# Altium schematic sheet 07_CONFIG.SchDoc
size OrCAD B
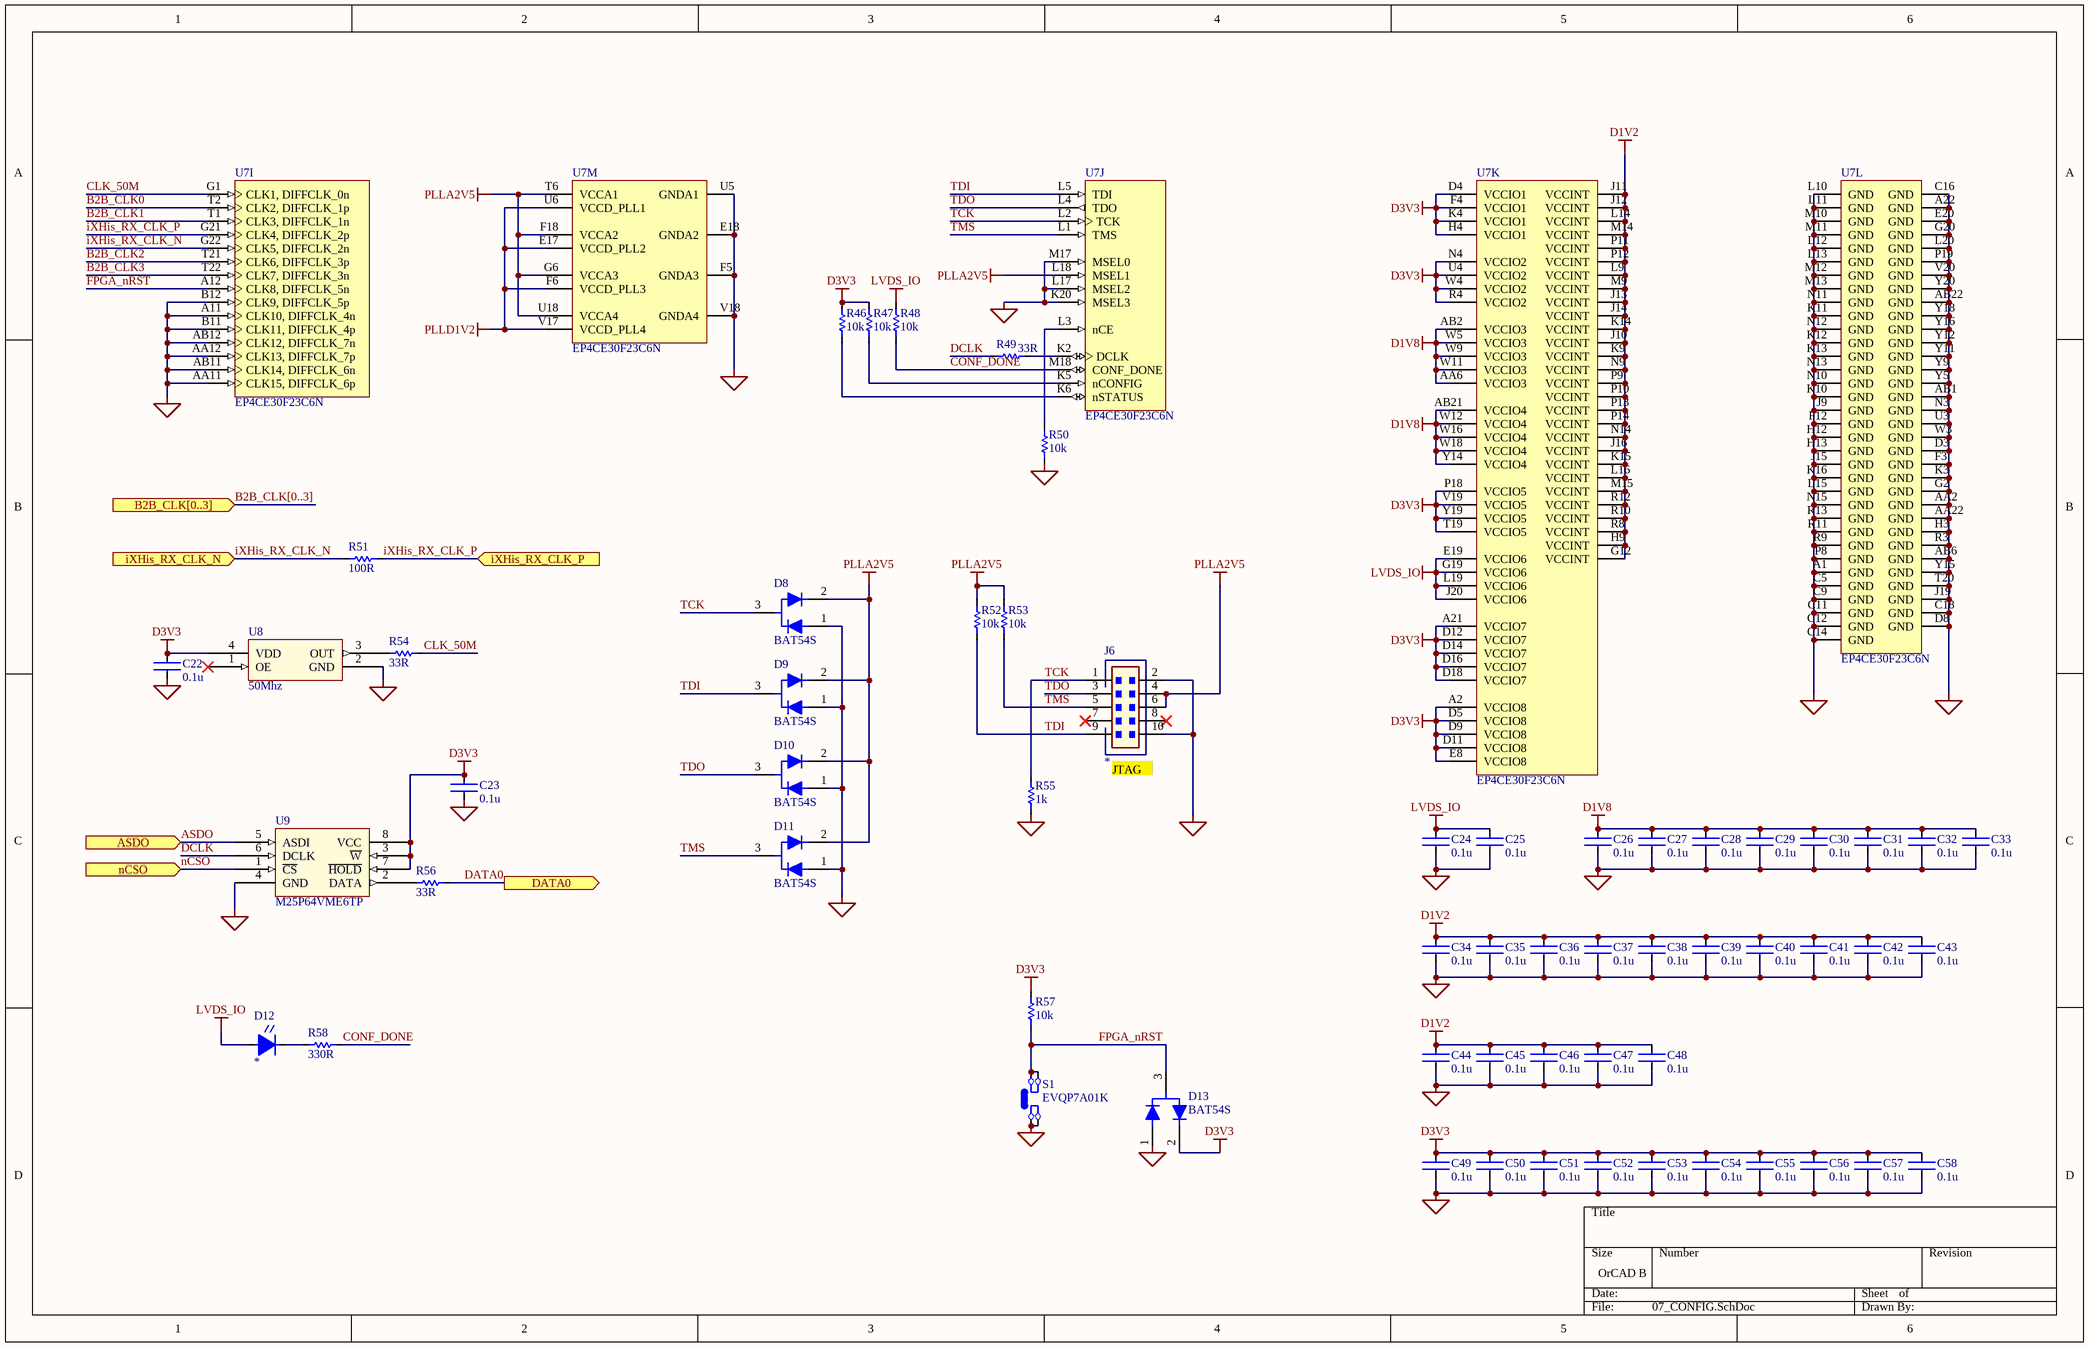
[diagram p0: 07_CONFIG.SchDoc]

## Parts
C22  0.1u  [C0402]
C23  0.1u  [C0402]
C24  0.1u  [C0402]
C25  0.1u  [C0402]
C26  0.1u  [C0402]
C27  0.1u  [C0402]
C28  0.1u  [C0402]
C29  0.1u  [C0402]
C30  0.1u  [C0402]
C31  0.1u  [C0402]
C32  0.1u  [C0402]
C33  0.1u  [C0402]
C34  0.1u  [C0402]
C35  0.1u  [C0402]
C36  0.1u  [C0402]
C37  0.1u  [C0402]
C38  0.1u  [C0402]
C39  0.1u  [C0402]
C40  0.1u  [C0402]
C41  0.1u  [C0402]
C42  0.1u  [C0402]
C43  0.1u  [C0402]
C44  0.1u  [C0402]
C45  0.1u  [C0402]
C46  0.1u  [C0402]
C47  0.1u  [C0402]
C48  0.1u  [C0402]
C49  0.1u  [C0402]
C50  0.1u  [C0402]
C51  0.1u  [C0402]
C52  0.1u  [C0402]
C53  0.1u  [C0402]
C54  0.1u  [C0402]
C55  0.1u  [C0402]
C56  0.1u  [C0402]
C57  0.1u  [C0402]
C58  0.1u  [C0402]
D8  BAT54S  [SOT95P230X110-3N_SOT23_BAT54]
D9  BAT54S  [SOT95P230X110-3N_SOT23_BAT54]
D10  BAT54S  [SOT95P230X110-3N_SOT23_BAT54]
D11  BAT54S  [SOT95P230X110-3N_SOT23_BAT54]
D12  *  [LED0603]
D13  BAT54S  [SOT95P230X110-3N_SOT23_BAT54]
J6  JTAG  [3011001XXX00]  (value not drawn)
R46  10k  [R0402]
R47  10k  [R0402]
R48  10k  [R0402]
R49  33R  [R0402]
R50  10k  [R0402]
R51  100R  [R0402]
R52  10k  [R0402]
R53  10k  [R0402]
R54  33R  [R0402]
R55  1k  [R0402]
R56  33R  [R0402]
R57  10k  [R0402]
R58  330R  [R0402]
S1  EVQP7A01K  [EVQP7A01K]
U7  EP4CE30F23C6N  [FBGA484_EP4CE30F23C6N]  (parts I,J,K,L,M of 13)
U8  50Mhz  [3225_DSO321SR]
U9  M25P64VME6TP  [VDFPN8_M25P64]

## Ports
ASDO (in), B2B_CLK[0..3] (in), DATA0 (out), iXHis_RX_CLK_N (in), iXHis_RX_CLK_P (in), nCSO (in)

## Nets
D1V2: C34.1 C35.1 C36.1 C37.1 C38.1 C39.1 C40.1 C41.1 C42.1 C43.1 C44.1 C45.1 C46.1 C47.1 C48.1 U7.G12(VCCINT) U7.H9(VCCINT) U7.J10(VCCINT) U7.J11(VCCINT) U7.J12(VCCINT) U7.J13(VCCINT) U7.J14(VCCINT) U7.J16(VCCINT) U7.K9(VCCINT) U7.K14(VCCINT) U7.K15(VCCINT) U7.L9(VCCINT) U7.L14(VCCINT) U7.L16(VCCINT) U7.M9(VCCINT) U7.M14(VCCINT) U7.M15(VCCINT) U7.N9(VCCINT) U7.N14(VCCINT) U7.P9(VCCINT) U7.P10(VCCINT) U7.P11(VCCINT) U7.P12(VCCINT) U7.P13(VCCINT) U7.P14(VCCINT) U7.R8(VCCINT) U7.R10(VCCINT) U7.R12(VCCINT)
D1V8: C26.1 C27.1 C28.1 C29.1 C30.1 C31.1 C32.1 C33.1 U7.AA6(VCCIO3) U7.AB2(VCCIO3) U7.AB21(VCCIO4) U7.W5(VCCIO3) U7.W9(VCCIO3) U7.W11(VCCIO3) U7.W12(VCCIO4) U7.W16(VCCIO4) U7.W18(VCCIO4) U7.Y14(VCCIO4)
D3V3: C22.1 C23.1 C49.1 C50.1 C51.1 C52.1 C53.1 C54.1 C55.1 C56.1 C57.1 C58.1 D13.2 R46.2 R47.2 R57.2 U7.A2(VCCIO8) U7.A21(VCCIO7) U7.D4(VCCIO1) U7.D5(VCCIO8) U7.D9(VCCIO8) U7.D11(VCCIO8) U7.D12(VCCIO7) U7.D14(VCCIO7) U7.D16(VCCIO7) U7.D18(VCCIO7) U7.E8(VCCIO8) U7.F4(VCCIO1) U7.H4(VCCIO1) U7.K4(VCCIO1) U7.N4(VCCIO2) U7.P18(VCCIO5) U7.R4(VCCIO2) U7.T19(VCCIO5) U7.U4(VCCIO2) U7.V19(VCCIO5) U7.W4(VCCIO2) U7.Y19(VCCIO5) U8.4(VDD) U9.3(~{W}) U9.7(~{HOLD}) U9.8(VCC)
GND: C22.2 C23.2 C24.2 C25.2 C26.2 C27.2 C28.2 C29.2 C30.2 C31.2 C32.2 C33.2 C34.2 C35.2 C36.2 C37.2 C38.2 C39.2 C40.2 C41.2 C42.2 C43.2 C44.2 C45.2 C46.2 C47.2 C48.2 C49.2 C50.2 C51.2 C52.2 C53.2 C54.2 C55.2 C56.2 C57.2 C58.2 D8.1 D9.1 D10.1 D11.1 D13.1 J6.2 J6.10 R50.1 R55.1 S1.1(CVdd) U7.A1(GND) U7.A11(CLK10,_DIFFCLK_4n) U7.A22(GND) U7.AA2(GND) U7.AA11(CLK15,_DIFFCLK_6p) U7.AA12(CLK13,_DIFFCLK_7p) U7.AA22(GND) U7.AB1(GND) U7.AB6(GND) U7.AB11(CLK14,_DIFFCLK_6n) U7.AB12(CLK12,_DIFFCLK_7n) U7.AB22(GND) U7.B11(CLK11,_DIFFCLK_4p) U7.B12(CLK9,_DIFFCLK_5p) U7.C5(GND) U7.C9(GND) U7.C11(GND) U7.C12(GND) U7.C14(GND) U7.C16(GND) U7.C18(GND) U7.D3(GND) U7.D8(GND) U7.E18(GNDA2) U7.E20(GND) U7.F3(GND) U7.F5(GNDA3) U7.F12(GND) U7.G2(GND) U7.G20(GND) U7.H3(GND) U7.H12(GND) U7.H13(GND) U7.J9(GND) U7.J15(GND) U7.J19(GND) U7.K3(GND) U7.K10(GND) U7.K11(GND) U7.K12(GND) U7.K13(GND) U7.K16(GND) U7.K20(MSEL3) U7.L10(GND) U7.L11(GND) U7.L12(GND) U7.L13(GND) U7.L15(GND) U7.L17(MSEL2) U7.L20(GND) U7.M10(GND) U7.M11(GND) U7.M12(GND) U7.M13(GND) U7.M17(MSEL0) U7.N3(GND) U7.N10(GND) U7.N11(GND) U7.N12(GND) U7.N13(GND) U7.N15(GND) U7.P8(GND) U7.P19(GND) U7.R3(GND) U7.R9(GND) U7.R11(GND) U7.R13(GND) U7.T20(GND) U7.U3(GND) U7.U5(GNDA1) U7.V18(GNDA4) U7.V20(GND) U7.W3(GND) U7.Y5(GND) U7.Y9(GND) U7.Y11(GND) U7.Y12(GND) U7.Y15(GND) U7.Y16(GND) U7.Y18(GND) U7.Y20(GND) U8.2(GND) U9.4(GND)
LVDS_IO: C24.1 C25.1 D12.1(L20) R48.2 U7.E19(VCCIO6) U7.G19(VCCIO6) U7.J20(VCCIO6) U7.L19(VCCIO6)
PLLA2V5: D8.2 D9.2 D10.2 D11.2 J6.4 J6.6 R52.2 R53.2 U7.F18(VCCA2) U7.G6(VCCA3) U7.L18(MSEL1) U7.T6(VCCA1) U7.U18(VCCA4)
PLLD1V2: U7.E17(VCCD_PLL2) U7.F6(VCCD_PLL3) U7.U6(VCCD_PLL1) U7.V17(VCCD_PLL4)
ASDO: U9.5(ASDI) ; port ASDO
B2B_CLK0: U7.T2(CLK2,_DIFFCLK_1p)
B2B_CLK1: U7.T1(CLK3,_DIFFCLK_1n)
B2B_CLK2: U7.T21(CLK6,_DIFFCLK_3p)
B2B_CLK3: U7.T22(CLK7,_DIFFCLK_3n)
CLK_50M: R54.2 U7.G1(CLK1,_DIFFCLK_0n)
CONF_DONE: R48.1 R58.2 U7.M18(CONF_DONE)
DATA0: R56.2 ; port DATA0
DCLK: R49.1 U9.6(DCLK)
FPGA_nRST: D13.3 R57.1 S1.2(CVdd) U7.A12(CLK8,_DIFFCLK_5n)
iXHis_RX_CLK_N: R51.1 U7.G22(CLK5,_DIFFCLK_2n) ; port iXHis_RX_CLK_N
iXHis_RX_CLK_P: R51.2 U7.G21(CLK4,_DIFFCLK_2p) ; port iXHis_RX_CLK_P
nCSO: U9.1(~{CS}) ; port nCSO
TCK: D8.3 J6.1 R55.2 U7.L2(TCK)
TDI: D9.3 J6.9 R52.1 U7.L5(TDI)
TDO: D10.3 J6.3 U7.L4(TDO)
TMS: D11.3 J6.5 R53.1 U7.L1(TMS)
NetD12_2: D12.2(L21) R58.1
NetR46_1: R46.1 U7.K6(nSTATUS)
NetR47_1: R47.1 U7.K5(nCONFIG)
NetR49_2: R49.2 U7.K2(DCLK)
NetR50_2: R50.2 U7.L3(nCE)
NetR54_1: R54.1 U8.3(OUT)
NetR56_1: R56.1 U9.2(DATA)

Not connected (* = marked no-connect by the designer): J6 7* 8*; U8 1(OE)*

## Buses and harness runs
bus B2B_CLK[0..3] = port B2B_CLK[0..3]

## Notes on the sheet
- (near J6) JTAG

## Library data of the parts
C22-C58 = CAP011: CAP,Ceramic,X7R,10%,16V,0.1uF,0402; Manufacturer1: *; Manufacturer2: *; PartNumberManufacturer1: *; UnitPrice: *; Value: 0.1u
D8-D11 D13 = BAT54S: Schottky Double Diodes,30V,200mA,SOT23,a1k2k1a2; Manufacturer1: NXP; Manufacturer2: *; PartNumberManufacturer1: BAT54S; PartNumberManufacturer2: *; UnitPrice: *
D12 = LED YellowGreen0603: LED,Yellow Green,2V,20mA,0603; Manufacturer1: *; PartNumberManufacturer2: *; Manufacturer2: *; PartNumberManufacturer1: *; UnitPrice: *
J6 = 3011001XXX00: Header,10Pin,Vertical,2.54mm Pitch,TH; Manufacturer1: *; Manufacturer2: *; PartNumberManufacturer1: *; PartNumberManufacturer2: *; UnitPrice: *; Comment_1: *
R46-R48 R50 R52 R53 R57 = RES012: RES,10k,1%,1/16W,0402; Manufacturer1: *; PartNumberManufacturer2: *; Manufacturer2: *; PartNumberManufacturer1: *; Value: 10k; UnitPrice: *
R49 R54 R56 = RES017: RES,33R,1%,1/16W,0402; Manufacturer1: *; PartNumberManufacturer2: *; Manufacturer2: *; PartNumberManufacturer1: *; Value: 33R; UnitPrice: *
R51 = RES019: RES,100R,1%,1/16W,0402; Manufacturer1: *; PartNumberManufacturer2: *; Manufacturer2: *; PartNumberManufacturer1: *; Value: 100R; UnitPrice: *
R55 = RES011: RES,1k,1%,1/16W,0402; PartNumberManufacturer2: *; Manufacturer2: *; PartNumberManufacturer1: *; UnitPrice: *; Manufacturer1: *; Value: 1k
R58 = RES0111: RES,330R,1%,1/16W,0402; Manufacturer1: *; PartNumberManufacturer2: *; Manufacturer2: *; PartNumberManufacturer1: *; Value: 330R; UnitPrice: *
S1 = EVQP7A01K: Switch,3.5x2.9,Normal open,SMD; Manufacturer1: Panasonic; Manufacturer2: *; PartNumberManufacturer2: *; PartNumberManufacturer1: EVQP7A01K; UnitPrice: *
U7 = EP4CE30F23C6N: IC,FPGA,28848 LEs,Speed-6,FBGA484; Manufacturer1: ALTERA; PartNumberManufacturer1: EP4CE30F23C6N; UnitPrice: *; PartNumberManufacturer2: *; Manufacturer2: *
U8 = DSO321SRAA-50MHz: IC,OSC,50MHz,3.3V,100ppm,3225; Manufacturer1: KDS; PartNumberManufacturer1: DSO321SRAA-50MHz; Manufacturer2: *; PartNumberManufacturer2: *; UnitPrice: *; Value: 50Mhz
U9 = M25P64VME6TP: IC,FLASH,64 Mbit,SPI,VDFPN8; Manufacturer1: Micron/ST; PartNumberManufacturer1: M25P64VME6TP; Manufacturer2: *; PartNumberManufacturer2: *; UnitPrice: *